# Altium schematic sheet BMS-MCU_old.SchDoc
size Tabloid; SheetNumber: 3; SheetTotal: 3
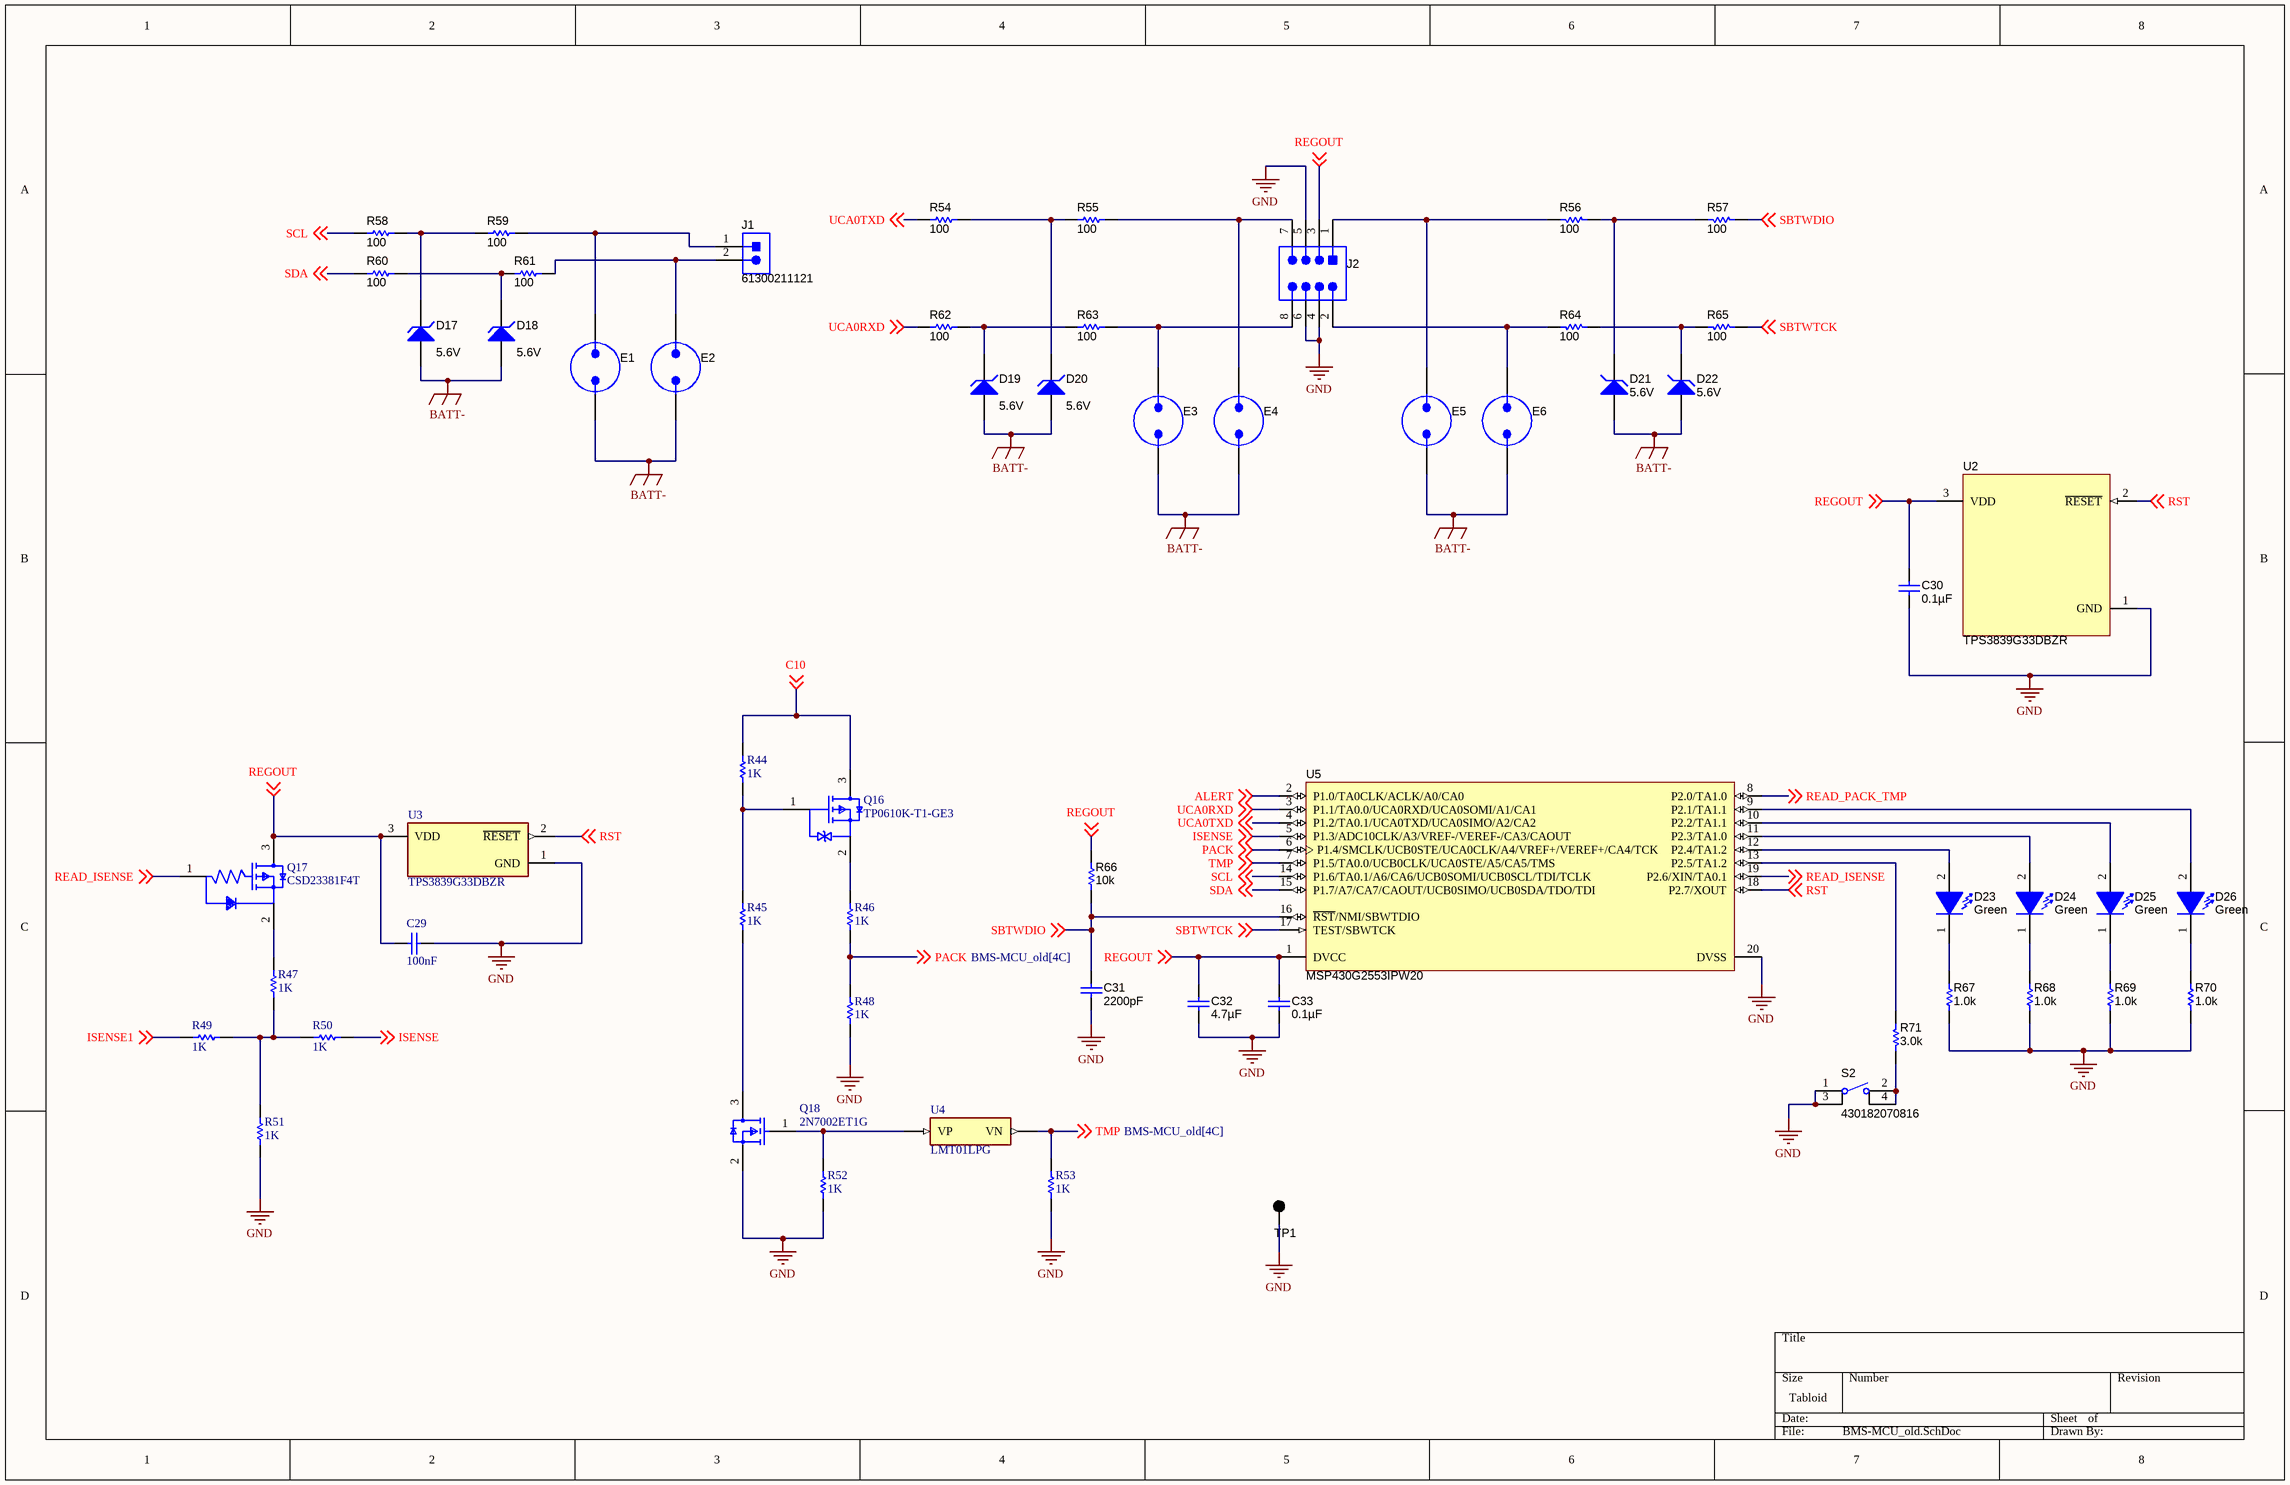
[diagram p0: BMS-MCU_old.SchDoc]

## Parts
C29  Capacitance: 100nF  [WCAP-CSGP_0603_L1.6W0.8H0.8_Reflow]  (hidden comment: 885012206046)
C30  ValueDisplayed: 0.1µF  [0603_095]  (hidden comment: 885012206046)
C31  ValueDisplayed: 2200pF  [0603_095]  (hidden comment: 885012206036)
C32  ValueDisplayed: 4.7µF  [0805_145]  (hidden comment: 885012207025)
C33  ValueDisplayed: 0.1µF  [0603_095]  (hidden comment: 885012206046)
D17  value 5.6V  [sod-323]  (hidden comment: MMSZ5232BS-7-F)
D18  value 5.6V  [sod-323]  (hidden comment: MMSZ5232BS-7-F)
D19  value 5.6V  [sod-323]  (hidden comment: MMSZ5232BS-7-F)
D20  value 5.6V  [sod-323]  (hidden comment: MMSZ5232BS-7-F)
D21  value 5.6V  [sod-323]  (hidden comment: MMSZ5232BS-7-F)
D22  value 5.6V  [sod-323]  (hidden comment: MMSZ5232BS-7-F)
D23  value Green  [WL-SMCW_GREEN]  (hidden comment: 150060GS75000)
D24  value Green  [WL-SMCW_GREEN]  (hidden comment: 150060GS75000)
D25  value Green  [WL-SMCW_GREEN]  (hidden comment: 150060GS75000)
D26  value Green  [WL-SMCW_GREEN]  (hidden comment: 150060GS75000)
E1  N/A  [SPARK_GAP2]  (value not drawn)  (no BOM)
E2  N/A  [SPARK_GAP2]  (value not drawn)  (no BOM)
E3  N/A  [SPARK_GAP2]  (value not drawn)  (no BOM)
E4  N/A  [SPARK_GAP2]  (value not drawn)  (no BOM)
E5  N/A  [SPARK_GAP2]  (value not drawn)  (no BOM)
E6  N/A  [SPARK_GAP2]  (value not drawn)  (no BOM)
J1  61300211121  [WURTH_61300211121]
J2  PEC04DAAN  [CONN_PEC04DAAN]  (value not drawn)
Q16  TP0610K-T1-GE3  [FP-S-03946-IPC_C]
Q17  CSD23381F4T  [FP-YJC0003A-MFG]
Q18  2N7002ET1G  [FP-318-08-MFG]
R44  value 1K  (hidden comment: Resistor)
R45  value 1K  (hidden comment: Resistor)
R46  value 1K  (hidden comment: Resistor)
R47  value 1K  (hidden comment: Resistor)
R48  value 1K  (hidden comment: Resistor)
R49  value 1K  (hidden comment: Resistor)
R50  value 1K  (hidden comment: Resistor)
R51  value 1K  (hidden comment: Resistor)
R52  value 1K  (hidden comment: Resistor)
R53  value 1K  (hidden comment: Resistor)
R54  value 100  [0805_HV]  (hidden comment: CRCW0805100RFKEA)
R55  value 100  [0805_HV]  (hidden comment: CRCW0805100RFKEA)
R56  value 100  [0805_HV]  (hidden comment: CRCW0805100RFKEA)
R57  value 100  [0805_HV]  (hidden comment: CRCW0805100RFKEA)
R58  value 100  [0805_HV]  (hidden comment: CRCW0805100RFKEA)
R59  value 100  [0805_HV]  (hidden comment: CRCW0805100RFKEA)
R60  value 100  [0805_HV]  (hidden comment: CRCW0805100RFKEA)
R61  value 100  [0805_HV]  (hidden comment: CRCW0805100RFKEA)
R62  value 100  [0805_HV]  (hidden comment: CRCW0805100RFKEA)
R63  value 100  [0805_HV]  (hidden comment: CRCW0805100RFKEA)
R64  value 100  [0805_HV]  (hidden comment: CRCW0805100RFKEA)
R65  value 100  [0805_HV]  (hidden comment: CRCW0805100RFKEA)
R66  ValueDisplayed: 10k  [0603]  (hidden comment: CRCW060310K0JNEA)
R67  ValueDisplayed: 1.0k  [0603]  (hidden comment: CRCW06031K00JNEA)
R68  ValueDisplayed: 1.0k  [0603]  (hidden comment: CRCW06031K00JNEA)
R69  ValueDisplayed: 1.0k  [0603]  (hidden comment: CRCW06031K00JNEA)
R70  ValueDisplayed: 1.0k  [0603]  (hidden comment: CRCW06031K00JNEA)
R71  ValueDisplayed: 3.0k  [0603]  (hidden comment: CRCW06033K00JNEA)
S2  430182070816  [SW_430182070816]
TP1  5001  [Keystone5001]  (value not drawn)
U2  TPS3839G33DBZR  [DBZ0003A_N]
U3  TPS3839G33DBZR  [FP-DBZ0003A-MFG]
U4  LMT01LPG  [FP-LPG0002A-MFG]
U5  MSP430G2553IPW20  [PW0020A_N]

## Nets
BATT-: D17.2(A) D18.2(A) D19.2(A) D20.2(A) D21.2(A) D22.2(A) E1.2 E2.2 E3.2 E4.2 E5.2 E6.2
GND: C29.2 C30.2 C31.2 C32.2 C33.2 J2.4 J2.5 J2.6 Q18.2(Source) R48.1 R51.1 R52.1 R53.1 R67.1 R68.1 R69.1 R70.1 S2.1 S2.3 TP1.1 U2.1(GND) U3.1(GND) U5.20(DVSS)
ALERT: U5.2(P1.0/TA0CLK/ACLK/A0/CA0) ; off-sheet ALERT
C10: Q16.3(D) R44.2 ; off-sheet C10
ISENSE: R50.1 U5.5(P1.3/ADC10CLK/A3/VREF-/VEREF-/CA3/CAOUT) ; off-sheet ISENSE
ISENSE1: R49.2 ; off-sheet ISENSE1
PACK: R46.1 R48.2 U5.6(P1.4/SMCLK/UCB0STE/UCA0CLK/A4/VREF+/VEREF+/CA4/TCK) ; off-sheet PACK
READ_ISENSE: Q17.1(G) U5.19(P2.6/XIN/TA0.1) ; off-sheet READ_ISENSE
READ_PACK_TMP: U5.8(P2.0/TA1.0) ; off-sheet READ_PACK_TMP
REGOUT: C29.1 C30.1 C32.1 C33.1 J2.3 Q17.3(D) R66.2 U2.3(VDD) U3.3(VDD) U5.1(DVCC) ; off-sheet REGOUT
RST: U2.2(~{RESET}) U3.2(~{RESET}) U5.18(P2.7/XOUT) ; off-sheet RST
SBTWDIO: C31.1 R57.1 R66.1 U5.16(~{RST}/NMI/SBWTDIO) ; off-sheet SBTWDIO
SBTWTCK: R65.1 U5.17(TEST/SBWTCK) ; off-sheet SBTWTCK
SCL: R58.1 U5.14(P1.6/TA0.1/A6/CA6/UCB0SOMI/UCB0SCL/TDI/TCLK) ; off-sheet SCL
SDA: R60.1 U5.15(P1.7/A7/CA7/CAOUT/UCB0SIMO/UCB0SDA/TDO/TDI) ; off-sheet SDA
TMP: R53.2 U4.1(VN) U5.7(P1.5/TA0.0/UCB0CLK/UCA0STE/A5/CA5/TMS) ; off-sheet TMP
UCA0RXD: R62.1 U5.3(P1.1/TA0.0/UCA0RXD/UCA0SOMI/A1/CA1) ; off-sheet UCA0RXD
UCA0TXD: R54.1 U5.4(P1.2/TA0.1/UCA0TXD/UCA0SIMO/A2/CA2) ; off-sheet UCA0TXD
NetD17_1: D17.1(K) R58.2 R59.1
NetD18_1: D18.1(K) R60.2 R61.1
NetD19_1: D19.1(K) R62.2 R63.1
NetD20_1: D20.1(K) R54.2 R55.1
NetD21_1: D21.1(K) R56.1 R57.2
NetD22_1: D22.1(K) R64.1 R65.2
NetD23_1: D23.1(K) R67.2
NetD23_2: D23.2(A) U5.12(P2.4/TA1.2)
NetD24_1: D24.1(K) R68.2
NetD24_2: D24.2(A) U5.11(P2.3/TA1.0)
NetD25_1: D25.1(K) R69.2
NetD25_2: D25.2(A) U5.10(P2.2/TA1.1)
NetD26_1: D26.1(K) R70.2
NetD26_2: D26.2(A) U5.9(P2.1/TA1.1)
NetE1_1: E1.1 J1.1 R59.2
NetE2_1: E2.1 J1.2 R61.2
NetE3_1: E3.1 J2.8 R63.2
NetE4_1: E4.1 J2.7 R55.2
NetE5_1: E5.1 J2.1 R56.2
NetE6_1: E6.1 J2.2 R64.2
NetQ16_1: Q16.1(G) R44.1 R45.2
NetQ16_2: Q16.2(S) R46.2
NetQ17_2: Q17.2(S) R47.2
NetQ18_1: Q18.1(Gate) R52.2 U4.2(VP)
NetQ18_3: Q18.3(Drain) R45.1
NetR47_1: R47.1 R49.1 R50.2 R51.2
NetR71_1: R71.1 S2.2 S2.4
NetR71_2: R71.2 U5.13(P2.5/TA1.2)

## Library data of the parts
C29 = CMP-03913-53914755-1: 885012206046 Multilayer Ceramic Capacitor, Wcap-Csgp Series, 0.1 F, 10%, X7R, 16 V, 0603 [1608 Metric] Rohs Compliant: Yes |Wurth...; Insulation Resistance: 5GΩ; Voltage Rating (DC): 16V; Length: 1.6mm; Tolerance: 10%; NexarPartId: 53914755; Case Code (Imperial): 0603; Case/Package: 0603; Height: 800µm; Mount: Surface Mount; Case Code (Metric): 1608; Thickness: 863.6µm; Voltage Rating: 16V; Min Operating Temperature: -55°C; Max Operating Temperature: 125°C; RoHS: Compliant; Packaging: Tape & Reel (TR); REACH SVHC: Unknown; Dielectric: X7R; Width: 800µm; Supplier 1: Mouser; Supplier Part Number 1: 710-885012206046; Supplier 2: Digikey; Supplier Part Number 2: 732-7965-1-ND
C30 C33 = 885012206046: CAP, CERM, 0.1 µF, 16 V, +/- 10%, X7R, 0603_095; Manufacturer: Wurth Elektronik; Polarized: N; CompType: Capacitor; Value: 0.1uF; U/M: EA; Cap_F: 0.0000001; Tolerance_%: 10; Value1: Unknown; VDC_V: 16; Value2: 16V; TaMin_C: -55; TaMax_C: 125; Cap_Case: 0603; SymbolVersion: 2008-07-09; PartNumber: 885012206046; PackageReference: 0603_095; RoHS: Y; MountType: SMT; Technology: Ceramic; TempCo: X7R; Published: 2008-06-19; Publisher: Texas Instruments; LatestRevisionDate: 2015-05-18; ComponentLink1Description: Datasheet link; ComponentLink1URL: http://katalog.we-online.de/pbs/datasheet/885012206046.pdf; Supplier 1: Mouser; Supplier Part Number 1: 710-885012206046
C31 = 885012206036: CAP, CERM, 2200 pF, 16 V, +/- 10%, X7R, 0603_095; Manufacturer: Wurth Elektronik; Polarized: N; CompType: Capacitor; Value: 2200pF; U/M: EA; Cap_F: 0.0000000022; Tolerance_%: 10; Value1: Unknown; VDC_V: 16; Value2: 16V; TaMin_C: -55; TaMax_C: 125; Cap_Case: 0603; SymbolVersion: 2008-07-09; PartNumber: 885012206036; PackageReference: 0603_095; RoHS: Y; MountType: SMT; Technology: Ceramic; TempCo: X7R; Published: 2008-06-19; Publisher: Texas Instruments; LatestRevisionDate: 2015-05-18; ComponentLink1Description: Datasheet link; ComponentLink1URL: http://katalog.we-online.de/pbs/datasheet/885012206036.pdf; Supplier 1: Mouser; Supplier Part Number 1: 710-885012206036
C32 = 885012207025: CAP, CERM, 4.7 µF, 10 V, +/- 10%, X7R, 0805; Manufacturer: Wurth Elektronik; Polarized: N; CompType: Capacitor; Value: 4.7uF; U/M: EA; Cap_F: 0.0000047; Tolerance_%: 10; Value1: Unknown; Value2: 10V; TaMin_C: -55; TaMax_C: 125; Cap_Case: 0805; SymbolVersion: 2008-07-09; PartNumber: 885012207025; PackageReference: 0805; RoHS: Y; VDC_V: 10; MountType: SMT; Technology: Ceramic; TempCo: X7R; Published: 2008-06-19; Publisher: Texas Instruments; LatestRevisionDate: 2015-05-18; ComponentLink1Description: Datasheet link; ComponentLink1URL: http://katalog.we-online.de/pbs/datasheet/885012207025.pdf; Supplier 1: Mouser; Supplier Part Number 1: 710-885012207025
D17-D22 = MMSZ5232BS-7-F: Diode, Zener, 5.6V, 200mW, SOD-323; Manufacturer: Diodes Inc.; U/M: EA; Power_W: 0.2; Vz_V: 5.6; Value1: 0.2W; RJA_CperW: 350; ComponentLink1URL: http://www.diodes.com/datasheets/ds31038.pdf; SymbolVersion: 2010-08-25; PackageReference: SOD-323; PartNumber: MMSZ5232BS-7-F; ComponentLink1Description: Datasheet link; CompType: Zener; Vr_V: N/A; MountType: SMT; RoHS: Y; Published: 2008-10-08; Publisher: Texas Instruments; LatestRevisionDate: 2013-02-11; LatestRevisionNote: Updated Supplier Data; Supplier 1: Digi-Key; Supplier Part Number 1: MMSZ5232BS-FDICT-ND; Supplier 2: Mouser; Supplier Part Number 2: 621-MMSZ5232BS-F
D23-D26 = 150060GS75000: LED, Green, SMD; Manufacturer: Wurth Elektronik; Type: InGaN; Vf_V: 3.2; Value2: 3.2V; Io_A: 0.02; Tjmax_C: 85; Value1: W; Angle: 140; U/M: EA; CompType: LED; PartNumber: 150060GS75000; SymbolVersion: 2008-11-06; MountType: SMT; RoHS: Y; PackageReference: LED_0603; Color: Green; Published: 2008-07-11; Publisher: Texas Instruments; ComponentLink1URL: http://katalog.we-online.de/led/datasheet/150060GS75000.pdf; ComponentLink1Description: Datasheet link; LatestRevisionDate: 2015-05-15; Supplier 1: Digi-Key; Supplier Part Number 1: 732-4971-1-ND; Supplier 2: Mouser; Supplier Part Number 2: 710-150060GS75000; Supplier 3: Farnell; Supplier Part Number 3: 2322070
E1-E6 = SPARKGAP: Spark Gap; SymbolCreator: a0412235; SymbolVersion: 2013-07-11; Manufacturer: N/A; PartNumber: N/A; Alternate Manufacturer: -; Alternate PartNumber: -; MountType: N/A; CompType: Spark Gap; Publisher: Texas Instruments; LatestRevisionDate: 2013-09-07; LatestRevisionNote: Added Alternate PartNumber and Alternate Manufacturer parameters to appropriate components.
J1 = 61300211121: Header, 2.54 mm, 2x1, Gold, TH; Manufacturer: Wurth Elektronik; SymbolCreator: a0412235; U/M: EA; SymbolVersion: 2013-10-31; PartNumber: 61300211121; PackageReference: Header, 2.54mm, 2x1, TH; ClassName: Header; CompType: Header; RoHS: Y; MountType: TH; ComponentLink1Description: Datasheet Link; ComponentLink1URL: http://katalog.we-online.de/em/datasheet/6130xx11121.pdf; Publisher: Texas Instruments; LatestRevisionDate: 2015-05-15; Supplier 1: Digi-Key; Supplier Part Number 1: 732-5315-ND; Supplier 2: Mouser; Supplier Part Number 2: 710-61300211121; Supplier 3: Farnell; Supplier Part Number 3: 2356153
J2 = PEC04DAAN: Header, 100mil, 4x2, Tin, TH; Manufacturer: Sullins Connector Solutions; SymbolCreator: a0411947; U/M: EA; SymbolVersion: 2013-12-22; PartNumber: PEC04DAAN; PackageReference: Header, 4x2, 100mil, Tin; ClassName: Header; CompType: Header; RoHS: Y; MountType: TH; ComponentLink1Description: Datasheet Link; ComponentLink1URL: http://www.sullinscorp.com/catalogs/97_Page78-79_HEADER_.100_2.54mm_MALE_BREAKAWAY.pdf; Publisher: Texas Instruments; LatestRevisionDate: 2015-06-02; Supplier 1: Digi-Key; Supplier Part Number 1: S2012E-04-ND
Q16 = CMP-02550-000326-1: MOSFET P-CH 60V 185MA SOT23-3; Nominal Vgs: -1V; Polarity: P-CHANNEL; Power Dissipation: 350mW; Element Configuration: Single; Threshold Voltage: -2V; Turn-Off Delay Time: 35ns; Turn-On Delay Time: 20ns; Gate to Source Voltage (Vgs): 20V; Number of Elements: 1; Drain to Source Voltage (Vdss): -60V; Input Capacitance: 155pF; Rds On Max: 190mR; Continuous Drain Current (ID): -185mA; Drain to Source Resistance: 10R; Max Operating Temperature: 150°C; Height: 1.02mm; Weight: 0.050717oz; Radiation Hardening: No; Package Quantity: 1; Min Operating Temperature: -55°C; Packaging: Tape and Reel; Case/Package: SOT-23-3; Width: 1.4mm; Mount: Surface Mount; Series: TrenchFET®; Length: 3.04mm; Max Power Dissipation: 350mW; RoHS Compliant: Yes; Drain to Source Breakdown Voltage: -60V; Number of Pins: 3; Lead Free: Lead Free; Number of Channels: 1; Supplier 1: Mouser; Supplier Part Number 1: 781-TP0610K-T1-GE3
Q17 = CMP-04962-000081-1: MOSFET P-CH 12V 2.3A 3PICOSTAR; Fall Time: 7ns; Threshold Voltage: -950mV; Number of Channels: 1; Drain to Source Breakdown Voltage: -12V; Gate to Source Voltage (Vgs): -8V; Input Capacitance: 236pF; Rise Time: 3.9ns; Max Power Dissipation: 500mW; Element Configuration: Single; Drain to Source Resistance: 175mR; Turn-On Delay Time: 4.5ns; Turn-Off Delay Time: 18ns; Max Operating Temperature: 150°C; Lead Free: Lead Free; Drain to Source Voltage (Vdss): 12V; Length: 1.04mm; Number of Pins: 3; Case/Package: QFN; Continuous Drain Current (ID): 2.3A; Width: 0.64mm; Min Operating Temperature: -55°C; REACH SVHC: No SVHC; Packaging: Tape and Reel; Package Quantity: 250; Rds On Max: 175mR; Mount: Surface Mount; RoHS Compliant: Yes; Height: 0.35mm; Supplier 1: Mouser; Supplier Part Number 1: 595-CSD23381F4T; Supplier 2: Digikey; Supplier Part Number 2: 296-37782-1-ND
Q18 = CMP-1058-00769-2: MOSFET N-CH 60V 260MA SOT-23; On-State Resistance: 2.5R; Turn-Off Delay Time: 4.8ns; Nominal Vgs: 1V; Element Configuration: Single; Rise Time: 1.2ns; Input Capacitance: 26.7pF; Number of Elements: 1; Turn-On Delay Time: 1.7ns; Gate to Source Voltage (Vgs): 20V; Max Power Dissipation: 300mW; Drain to Source Breakdown Voltage: 60V; Max Operating Temperature: 150°C; REACH SVHC: No SVHC; Case/Package: SOT-23-3; Lead Free: Lead Free; Length: 2.9mm; Height: 0.94mm; Package Quantity: 3000; Min Operating Temperature: -55°C; Radiation Hardening: No; Packaging: Tape and Reel; Fall Time: 1.2ns; Drain to Source Resistance: 2.5R; Halogen Free: Halogen Free; Threshold Voltage: 1V; Number of Pins: 3; Continuous Drain Current (ID): 260mA; Rds On Max: 2.5R; Power Dissipation: 300mW; Width: 1.3mm; Supplier 1: Mouser; Supplier Part Number 1: 863-2N7002ET1G; Supplier 2: Digikey; Supplier Part Number 2: 2N7002ET1GOSCT-ND
R44-R53 = Resistor: TC1: 0; SimulationGenericComponent: True; TC2: 0
R54-R65 = CRCW0805100RFKEA: RES, 100 ohm, 1%, 0.125W, 0805; Manufacturer: Vishay-Dale; CompType: Resistor; Value_Code: 100R; Tolerance_%: 1; Power_W: 0.125; VDC_V: 150; TempCo: 100 ppm/C; EIA_Code: E96; U/M: EA; SymbolVersion: 2009-05-29; PartNumber: CRCW0805100RFKEA; PackageReference: 0805; RoHS: Y; Res_ohm: 100; Value1: 1%; Value2: 0.125W; MountType: SMT; Technology: Thick Film; Published: 2008-06-26; Publisher: Texas Instruments; LatestRevisionDate: 2013-01-08; ComponentLink1Description: Datasheet link; ComponentLink1URL: http://www.vishay.com/docs/20035/dcrcwe3.pdf; Supplier 1: Digi-Key; Supplier Part Number 1: 541-100CCT-ND; Supplier 2: Mouser; Supplier Part Number 2: 71-CRCW0805-100-E3; Supplier 3: Farnell; Supplier Part Number 3: 1469862
R66 = CRCW060310K0JNEA: RES, 10 k, 5%, 0.1 W, 0603; Manufacturer: Vishay-Dale; CompType: Resistor; Value: 10k; Res_ohm: 10000; Value_Code: 10k0; Tolerance_%: 5; Power_W: 0.1; Value2: 0.1W; VDC_V: 75; TempCo: 200 ppm/C; EIA_Code: E24; U/M: EA; SymbolVersion: 2009-05-29; PartNumber: CRCW060310K0JNEA; PackageReference: 0603; RoHS: Y; Value1: 5%; MountType: SMT; Technology: Thick Film; Published: 2008-06-26; Publisher: Texas Instruments; LatestRevisionDate: 2015-04-06; ComponentLink1Description: Datasheet link; ComponentLink1URL: http://www.vishay.com/docs/20035/dcrcwe3.pdf; Supplier 1: Digi-Key; Supplier Part Number 1: 541-10KGCT-ND; Supplier 2: Mouser; Supplier Part Number 2: 71-CRCW0603J-10K-E3; Supplier 3: Farnell; Supplier Part Number 3: 1469749
R67-R70 = CRCW06031K00JNEA: RES, 1.0 k, 5%, 0.1 W, 0603; Manufacturer: Vishay-Dale; CompType: Resistor; Value: 1.0k; Res_ohm: 1000; Value_Code: 1k00; Tolerance_%: 5; Power_W: 0.1; Value2: 0.1W; VDC_V: 75; TempCo: 200 ppm/C; EIA_Code: E24; U/M: EA; SymbolVersion: 2009-05-29; PartNumber: CRCW06031K00JNEA; PackageReference: 0603; RoHS: Y; Value1: 5%; MountType: SMT; Technology: Thick Film; Published: 2008-06-26; Publisher: Texas Instruments; LatestRevisionDate: 2015-04-06; ComponentLink1Description: Datasheet link; ComponentLink1URL: http://www.vishay.com/docs/20035/dcrcwe3.pdf; Supplier 1: Digi-Key; Supplier Part Number 1: 541-1.0KGCT-ND; Supplier 2: Mouser; Supplier Part Number 2: 71-CRCW0603J-1.0K-E3; Supplier 3: Farnell; Supplier Part Number 3: 1652851
R71 = CRCW06033K00JNEA: RES, 3.0 k, 5%, 0.1 W, 0603; Manufacturer: Vishay-Dale; CompType: Resistor; Value: 3.0k; Res_ohm: 3000; Value_Code: 3k00; Tolerance_%: 5; Power_W: 0.1; Value2: 0.1W; VDC_V: 75; TempCo: 200 ppm/C; EIA_Code: E24; U/M: EA; SymbolVersion: 2009-05-29; PartNumber: CRCW06033K00JNEA; PackageReference: 0603; RoHS: Y; Value1: 5%; MountType: SMT; Technology: Thick Film; Published: 2008-06-26; Publisher: Texas Instruments; LatestRevisionDate: 2015-04-06; ComponentLink1Description: Datasheet link; ComponentLink1URL: http://www.vishay.com/docs/20035/dcrcwe3.pdf; Supplier 1: Digi-Key; Supplier Part Number 1: 541-3.0KGCT-ND; Supplier 2: Mouser; Supplier Part Number 2: 71-CRCW0603J-3.0K-E3; Supplier 3: Farnell; Supplier Part Number 3: 1563613
S2 = 430182070816: Switch, SPST-NO, Off-Mom, 1 Pos, 0.05A, 12 VDC, SMT; Manufacturer: Wurth Elektronik; SymbolCreator: Altium; VDC_V: 12; PositionCount: 1; CurrentRating_mA: 50; SymbolVersion: 2015-04-24; PartNumber: 430182070816; MountType: SMT; ComponentLink1Description: Datasheet Link; ComponentLink1URL: http://katalog.we-online.de/em/datasheet/4301x2.pdf; RoHS: Y; Circuit: SPST-NO; SwitchFunction: Off-Mom; Orientation: Top Actuated; CompType: Switch; PackageReference: 6.2x6.2mm; Publisher: Texas Instruments; LatestRevisionDate: 2015-05-26; Supplier 1: Digi-Key; Supplier Part Number 1: 732-7006-1-ND
TP1 = 5001: Test Point, Miniature, Black, TH; Manufacturer: Keystone; CompType: Test Point Loop; U/M: EA; SymbolVersion: 2008-04-04; PartNumber: 5001; PackageReference: Black Miniature Testpoint; RoHS: Y; MountType: TH; ComponentLink1Description: Datasheet Link; ComponentLink1URL: http://www.keyelco.com/userAssets/file/M60-2p60.pdf; Value: Black; Publisher: Texas Instruments; LatestRevisionDate: 2015-05-13; Supplier 1: Digi-Key; Supplier Part Number 1: 5001K-ND
U2 = TPS3839G33DBZR: Ultralow Power, Supply Voltage Supervisor, DBZ0003A; Alternate PartNumber: TPS3839G33DBZT; Manufacturer: Texas Instruments; SymbolCreator: Altium; CompType: IC; U/M: EA; SymbolVersion: 2014-11-18; PartNumber: TPS3839G33DBZR; PackageReference: DBZ0003A; MountType: SMT; ComponentLink1Description: Datasheet Link; ComponentLink1URL: http://www.ti.com/lit/ds/symlink/tps3839a09.pdf; RoHS: Y; Publisher: Texas Instruments; LatestRevisionDate: 2015-04-21; Alternate Manufacturer: Texas Instruments
U3 = CMP-04919-000025-1: IC SUPERVISOR 1 CHANNEL SOT23-3; Output: TOTEM-POLE; Reset Timeout: 120ms; Quiescent Current: 150nA; Watchdog Timer: No; Reset: Active Low; Min Supply Voltage: 600mV; Threshold Voltage: 3.08V; Max Reset Threshold Voltage: 3.126V; Max Supply Voltage: 6.5V; Max Supply Current: 500nA; Min Reset Threshold Voltage: 3.003V; Number of Voltages Monitored: 1; RoHS Compliant: Yes; Number of Pins: 3; Max Operating Temperature: 85°C; Case/Package: SOT-23; Radiation Hardening: No; Packaging: Tape and Reel; Min Operating Temperature: -40°C; Type: Simple Reset/Power-On Reset; Package Quantity: 3000; Series: TPS3839G33; Mount: Surface Mount; Lead Free: Lead Free; Supplier 1: Mouser; Supplier Part Number 1: 595-TPS3839G33DBZR
U4 = CMP-04948-000023-1: SENSOR DIGITAL -50C-150C TO92-2; Manufacturer: Texas Instruments; Max Supply Voltage: 5.5V; Resolution: 13bits; Operating Supply Current: 39uA; Min Supply Voltage: 2V; Sensor Output: Analog Voltage,Other; Ambient Temperature Range Low: -50°C; Category: IC; Temperature: -50°C to +150°C; Octopart: https://octopart.com/lmt01lpg-texas+instruments-60770464; Digikey Description: SENSOR DIGITAL -50C-150C TO92-2; Temperature Range High: +150°C; Device Class L2: Temperature and Humidity Sensors; Mouser Description: 0.5°C Accurate 2-pin Temperature Sensor with a Pulse Train Interface 2-TO-92 -50 to 150; Package: LPG0002A; Ambient Temperature Range High: +150°C; Manufacturer Part Number: LMT01LPG; Lead Free: Yes; Height: 5.05mm; ComponentLink2URL: https://www.ti.com/lit/ds/symlink/lmt01.pdf; Temperature Range Low: -50°C; ComponentLink2Description: Datasheet; Automotive: No; Device Class L3: unset; RoHS: TRUE; Device Class L1: Sensors; Supplier 1: Mouser; Supplier Part Number 1: 595-LMT01LPG
U5 = MSP430G2553IPW20: 16 MHz Mixed Signal Microcontroller with 16 KB Flash, 512 B SRAM and 24 GPIOs, -40 to 85 degC, 20-pin SOP (PW), Green (RoHS & no Sb/Br); Alternate Manufacturer: Texas Instruments; Alternate PartNumber: Equivalent; ADC: 10-bit SAR; ADC Channels: 8; Brown Out Reset: Yes; Flash(KB): 16; GPIO: 24; Pin/Package: 0DIESALE, 0WAFERSALE, 20PDIP, 20TSSOP, 28TSSOP, 32QFN; SRAM(B): 512; SubFamily: Value Line; Timers - 16-bit: 2; USCI_A (UART/LIN/IrDA/SPI): 1; DatasheetVersion: SLAS735G; PackageVersion: 4040064-5/G, 02/2011; PackageReference: PW0020A; PackageDescription: 20-Pin Plastic Small Outline, Body 6.5 x 4.4 mm, Pitch 0.65 mm; Cap touch I/O: Yes; Comparators: Yes; Eco-Plan: Green (RoHS & no Sb/Br); Frequency(MHz): 16; Temp Sensor: Yes; USCI_B (I2C & SPI): 1; Watchdog: Yes; MountType: SMT; Code_JEDEC: MO-153; ComponentLink1Description: Manufacturer URL; ComponentLink1URL: http://www.ti.com/; ComponentLink2Description: Datasheet; ComponentLink2URL: http://www.ti.com/general/docs/lit/getliterature.tsp?genericPartNumber=MSP430G2553&fileType=pdf; PartNumber: MSP430G2553IPW20; Manufacturer: Texas Instruments